# Altium project Remotely operated car.PrjPcb
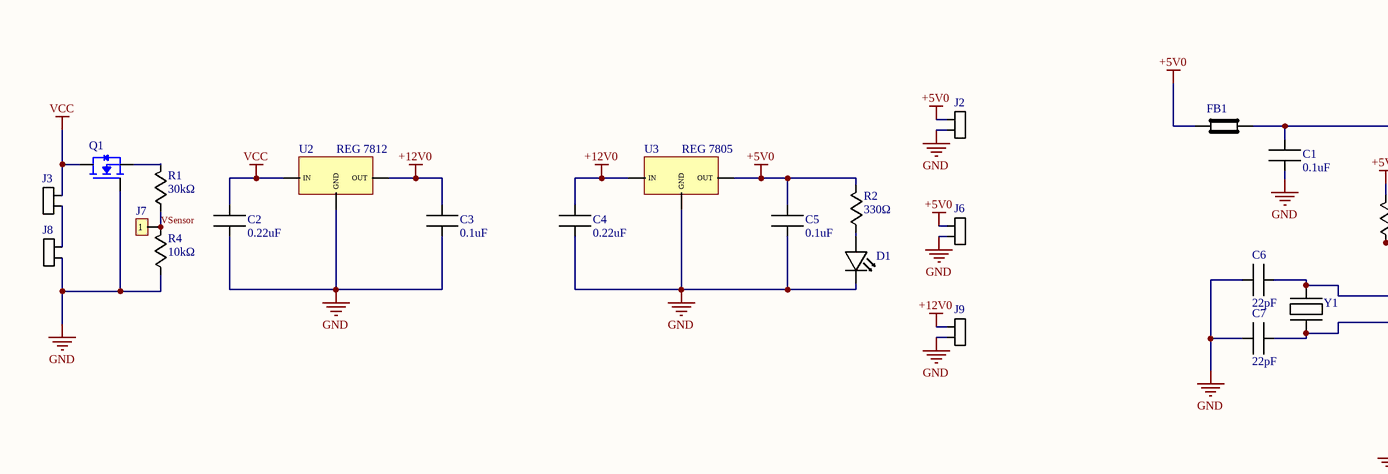
[diagram p0: Microcontroller circuit.SchDoc, left]
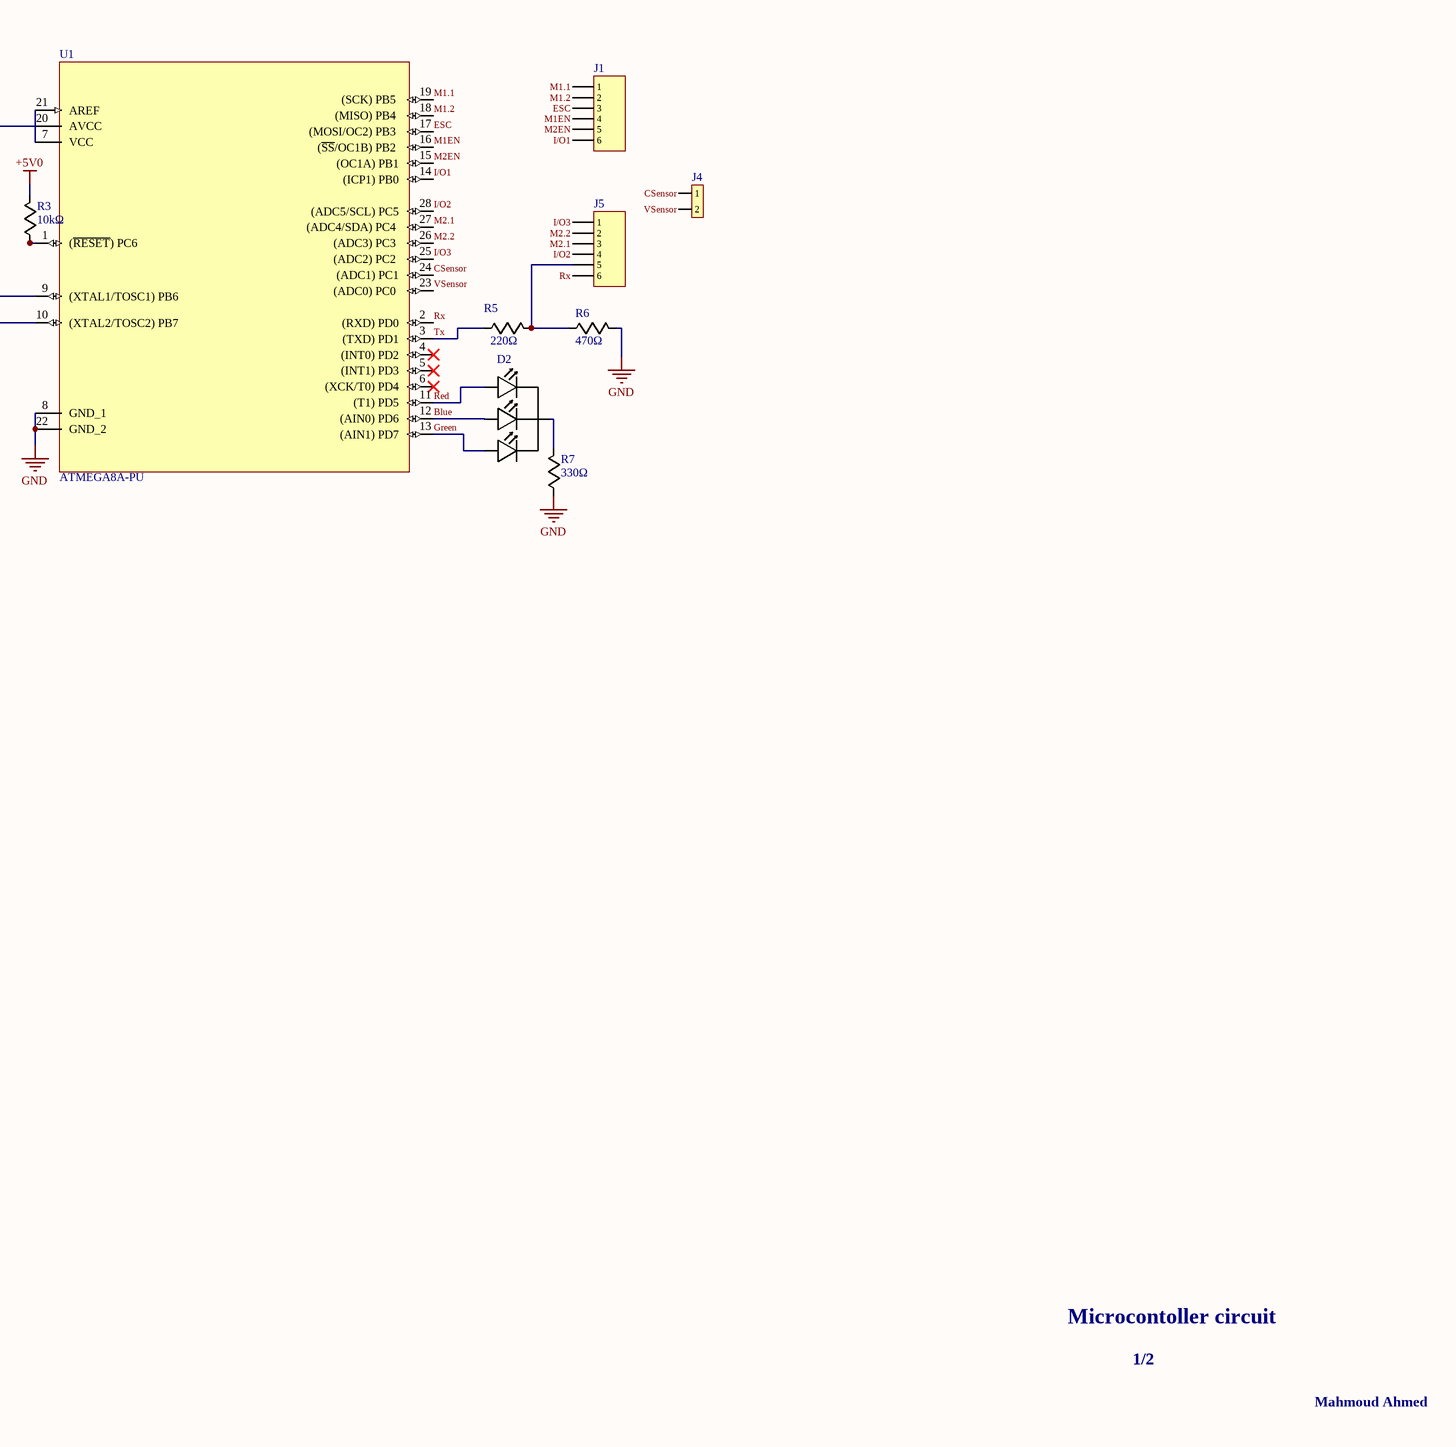
[diagram p1: Microcontroller circuit.SchDoc, right]
1 sheet, 31 parts. Net scope: global (net labels, ports and power ports of the same name join across sheets).
Board file: Microcontroller circuit.PcbDoc

## Sheet Microcontroller circuit.SchDoc
size A2

### Parts
C1  0.1uF  [C0805]
C2  0.22uF  [C0805]
C3  0.1uF  [C0805]
C4  0.22uF  [C0805]
C5  0.1uF  [C0805]
C6  22pF  [C0805]
C7  22pF  [C0805]
D1  RedLED  [THT_LED]  (value not drawn)
D2  WP154A4SUREQBFZGC  [RGB LED]  (value not drawn)
FB1  BKP2125HS101-T  [FB0805]  (value not drawn)
J1  M20-7820646  [HDR 1x6F]  (value not drawn)
J2  102-6179-ND  [Terminal block]  (value not drawn)
J3  102-6179-ND  [Terminal block]  (value not drawn)
J4  68000-202HLF  [HDR 1x2M]  (value not drawn)
J5  M20-7820646  [HDR 1x6F]  (value not drawn)
J6  102-6179-ND  [Terminal block]  (value not drawn)
J7  PH1-01-UA  [HDR 1x1M]  (value not drawn)
J8  102-6179-ND  [Terminal block]  (value not drawn)
J9  102-6179-ND  [Terminal block]  (value not drawn)
Q1  IRF9530NPBF  [IRF9530NPBF]  (value not drawn)
R1  30kΩ  [R0805]
R2  330Ω  [R0805]
R3  10kΩ  [R1206]
R4  10kΩ  [R1206]
R5  220Ω  [R0805]
R6  470Ω  [R0805]
R7  330Ω  [R0805]
U1  ATMEGA8A-PU  [ATmega8A]
U2  REG 7812  [REG 78xx]
U3  REG 7805  [REG 78xx]
Y1  ECS-040-20-4X-DU  [Crystal]  (value not drawn)

### Nets
+5V0: C5.2 FB1.2 J2.1 J6.1 R2.2 R3.2 U3.3(OUT)
+12V0: C3.2 C4.1 J9.1 U2.3(OUT) U3.1(IN)
GND: C1.1 C2.2 C3.1 C4.2 C5.1 C6.1 C7.1 D1.1(cathode) J2.2 J6.2 J8.1 J9.2 Q1.1(G) R4.1 R6.2 R7.1 U1.8(GND_1) U1.22(GND_2) U2.2(GND) U3.2(GND)
VCC: C2.1 J3.1 Q1.2(D) U2.1(IN)
Blue: D2.3(Blue) U1.12((AIN0)_PD6)
CSensor: J4.1 U1.24((ADC1)_PC1)
ESC: J1.3 U1.17((MOSI/OC2)_PB3)
Green: D2.4(Green) U1.13((AIN1)_PD7)
I/O1: J1.6 U1.14((ICP1)_PB0)
I/O2: J5.4 U1.28((ADC5/SCL)_PC5)
I/O3: J5.1 U1.25((ADC2)_PC2)
M1.1: J1.1 U1.19((SCK)_PB5)
M1.2: J1.2 U1.18((MISO)_PB4)
M1EN: J1.4 U1.16((~{SS}/OC1B)_PB2)
M2.1: J5.3 U1.27((ADC4/SDA)_PC4)
M2.2: J5.2 U1.26((ADC3)_PC3)
M2EN: J1.5 U1.15((OC1A)_PB1)
Red: D2.1(Red) U1.11((T1)_PD5)
Rx: J5.6 U1.2((RXD)_PD0)
Tx: R5.1 U1.3((TXD)_PD1)
VSensor: J4.2 J7.1 R1.1 R4.2 U1.23((ADC0)_PC0)
NetC1_2: C1.2 FB1.1 U1.7(VCC) U1.20(AVCC) U1.21(AREF)
NetC6_2: C6.2 U1.9((XTAL1/TOSC1)_PB6) Y1.2
NetC7_2: C7.2 U1.10((XTAL2/TOSC2)_PB7) Y1.1
NetD1_2: D1.2(Anode) R2.1
NetD2_2: D2.2(Common_Cathode) R7.2
NetJ3_2: J3.2 J8.2
NetJ5_5: J5.5 R5.2 R6.1
NetQ1_3: Q1.3(S) R1.2
NetR3_1: R3.1 U1.1((~{RESET})_PC6)

Not connected (* = marked no-connect by the designer): U1 4((INT0)_PD2)* 5((INT1)_PD3)* 6((XCK/T0)_PD4)*

### Notes on the sheet
- Microcontoller circuit
- 1/2
- Mahmoud Ahmed

### Library data of the parts
C1 C3 C5 = 0.1uF CAP: CAP CER 0.1UF 50V X7R 0805; Manufacturer: TDK Corporation; MPN: C2012X7R1H104K085AA; SPN: 445-7534-1-ND; Supplier: DigiKey
C2 C4 = 0.22uF CAP: CAP CER 0.22UF 25V X7R 0805; MPN: CC0805KRX7R8BB224; Manufacturer: YAGEO; SPN: 311-1432-1-ND; Supplier: DigiKey
C6 C7 = 22pF CAP: CAP THIN FILM 22PF 50V 0805; MPN: 08055J220FBTTR; Manufacturer: KYOCERA AVX; SPN: 478-11911-1-ND; Supplier: DigiKey
D1 = WP132XIT: LED RED CLEAR T-1 T/H; Manufacturer: Kingbright; SPN: 754-1710-ND; MPN: WP132XIT; Supplier: DigiKey
D2 = RGB LED: LED RGB CLEAR T-1 3/4 T/H; Manufacturer: Kingbright; SPN: 754-1615-ND; MPN: WP154A4SUREQBFZGC; Supplier: DigiKey
FB1 = Ferrite Bead: FERRITE BEAD 100 OHM 0805 1LN; Manufacturer: Taiyo Yuden; SPN: 587-1929-1-ND; MPN: BKP2125HS101-T; Supplier: DigiKey
J1 J5 = HDR 1x6F: CONN RCPT 6POS 0.1 TIN PCB; Manufacturer: Harwin Inc.; SPN: 952-1809-ND; MPN: M20-7820646; Supplier: DigiKey
J2 J3 J6 J8 J9 = Terminal block: TERMINAL BLOCK, SCREW TYPE, 5.08; MPN: TB004-508-02BE; Manufacturer: CUI Devices; Supplier: DigiKey; Parameter 1: 102-6179-ND
J4 = HDR 1x2M: CONN HEADER VERT 2POS 2.54MM; Manufacturer: Amphenol ICC (FCI); SPN: 609-3502-ND; MPN: 68000-202HLF; Supplier: DigiKey
J7 = HDR 1x1M: CONN HEADER VERT 1POS 2.54MM; Manufacturer: Adam Tech; SPN: 2057-PH1-01-UA-ND; MPN: PH1-01-UA; Supplier: DigiKey
Q1 = IRF9530NPBF: MOSFET P-CH 100V 14A TO220AB; Manufacturer: Infineon Technologies; SPN: IRF9530NPBF-ND; MPN: IRF9530NPBF; Supplier: DigiKey
R1 R2 R5-R7 = 330Ω RES: RES 330 OHM 1% 1/8W 0805; MPN: RC0805FR-07330RL; Manufacturer: YAGEO; SPN: 311-330CRCT-ND; Supplier: DigiKey
R3 R4 = 10kΩ RES: RES 10K OHM 1% 1/4W 1206; MPN: RC1206FR-0710KL; Manufacturer: YAGEO; SPN: 311-10.0KFRCT-ND; Supplier: DigiKey
U1 = ATmega8: IC MCU 8BIT 8KB FLASH 28DIP; Manufacturer: Microchip Technology; SPN: ATMEGA8A-PU-ND; MPN: ATMEGA8A-PU; Supplier: DigiKey; ComponentLink1Description: Datasheet; ComponentLink1URL: https://ww1.microchip.com/downloads/en/DeviceDoc/ATmega8A-Data-Sheet-DS40001974B.pdf
U2 = LM7812CT/NOPB: IC REG LINEAR 12V 1A TO220-3; Manufacturer: Texas Instruments; SPN: 296-50628-ND; MPN: LM7812CT/NOPB; Supplier: DigiKey
U3 = LM7805CT/NOPB: IC REG LINEAR 5V 1A TO220-3; Manufacturer: Texas Instruments; SPN: 296-47192-ND; MPN: LM7805CT/NOPB; Supplier: DigiKey; ComponentLink1Description: Datasheet; ComponentLink1URL: https://www.ti.com/general/docs/suppproductinfo.tsp?distId=10&gotoUrl=https%3A%2F%2Fwww.ti.com%2Flit%2Fgpn%2Flm340
Y1 = Crystal 4MHz: CRYSTAL 4.0000MHZ 20PF TH; Manufacturer: ECS Inc.; SPN: XC1920-ND; MPN: ECS-040-20-4X-DU; Supplier: DigiKey